# Altium schematic sheet gnss_module_evaluation_shield_schematic.SchDoc: GNSS Modules evaluation shield
size A4; ApprovedBy: -; Author: Morozov A. L.; Address1: morozovars@yandex.ru; Address2: Kazan; Address3: Russian Federation; SheetNumber: 1; SheetTotal: 1
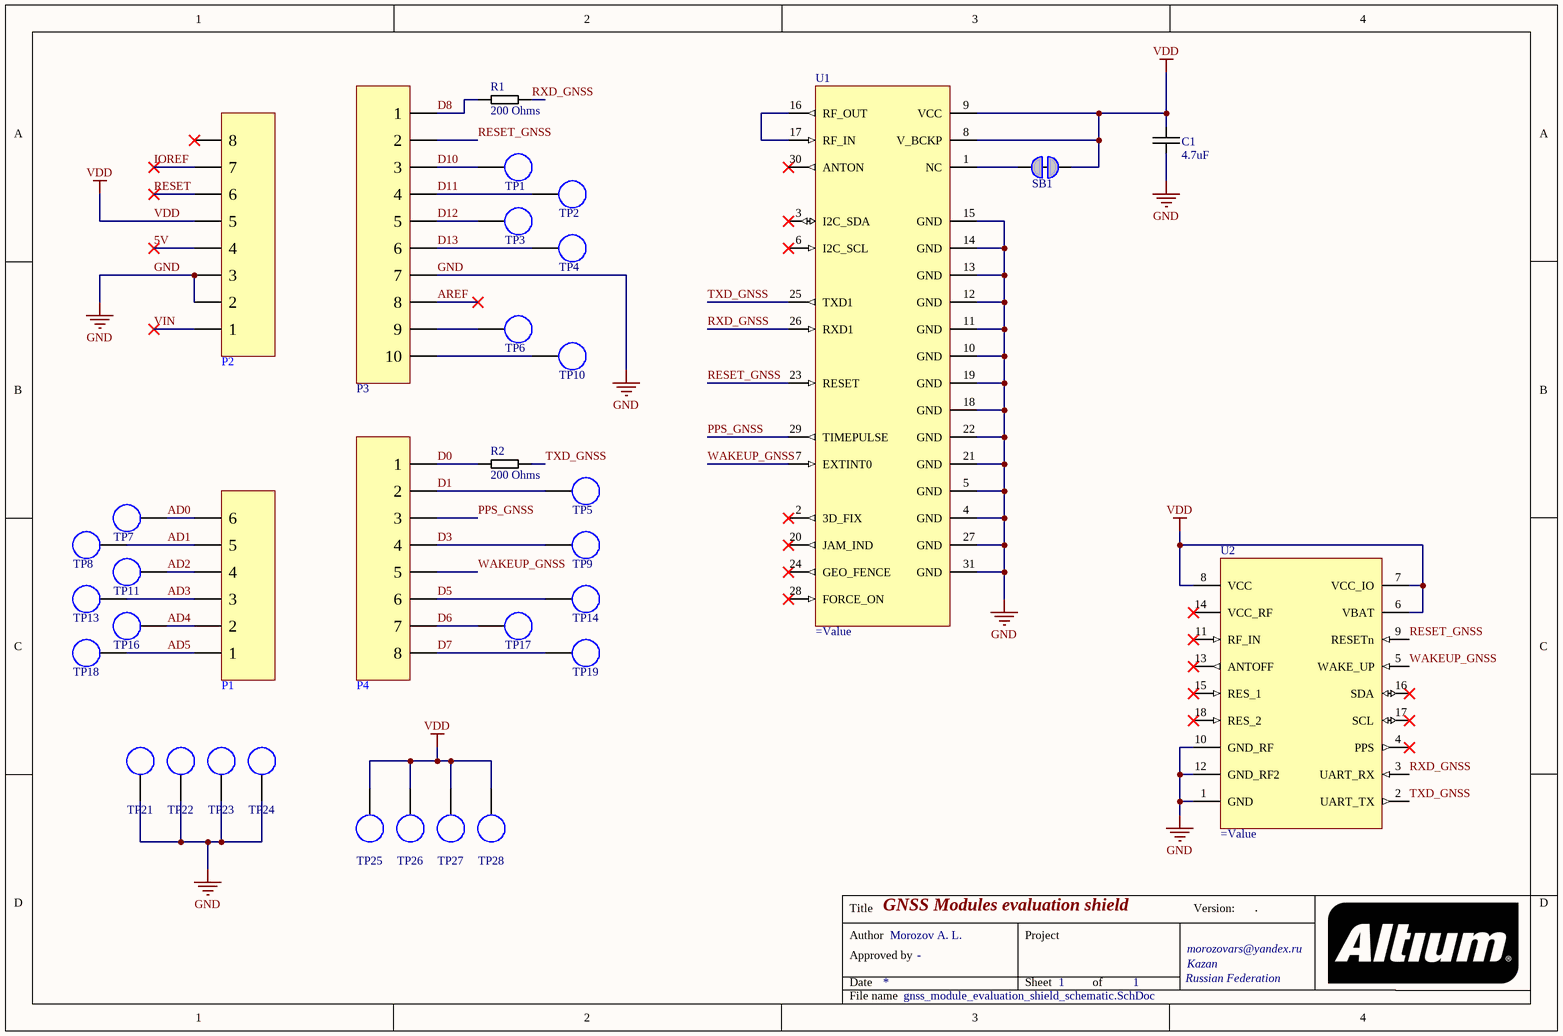
[diagram p0: gnss_module_evaluation_shield_schematic.SchDoc]

## Parts
C1  4.7uF  [CAP0805]
P1  SSQ-106-03-G-S  [Header 6x1 8.5mm]  (value not drawn)
P2  SSQ-108-03-G-S  [Header 8x1 8.5mm]  (value not drawn)
P3  SSQ-110-03-G-S  [Header 10x1 8.5mm]  (value not drawn)
P4  SSQ-108-03-G-S  [Header 8x1 8.5mm]  (value not drawn)
R1  200 Ohms  [R0402]
R2  200 Ohms  [R0402]
SB1  *  [Solderbridge_Shorted]  (value not drawn)  (net tie, no BOM)
TP1  *  [TP_1MM]  (value not drawn)  (no BOM)
TP2  *  [TP_1MM]  (value not drawn)  (no BOM)
TP3  *  [TP_1MM]  (value not drawn)  (no BOM)
TP4  *  [TP_1MM]  (value not drawn)  (no BOM)
TP5  *  [TP_1MM]  (value not drawn)  (no BOM)
TP6  *  [TP_1MM]  (value not drawn)  (no BOM)
TP7  *  [TP_1MM]  (value not drawn)  (no BOM)
TP8  *  [TP_1MM]  (value not drawn)  (no BOM)
TP9  *  [TP_1MM]  (value not drawn)  (no BOM)
TP10  *  [TP_1MM]  (value not drawn)  (no BOM)
TP11  *  [TP_1MM]  (value not drawn)  (no BOM)
TP13  *  [TP_1MM]  (value not drawn)  (no BOM)
TP14  *  [TP_1MM]  (value not drawn)  (no BOM)
TP16  *  [TP_1MM]  (value not drawn)  (no BOM)
TP17  *  [TP_1MM]  (value not drawn)  (no BOM)
TP18  *  [TP_1MM]  (value not drawn)  (no BOM)
TP19  *  [TP_1MM]  (value not drawn)  (no BOM)
TP21  *  [TP_1MM]  (value not drawn)  (no BOM)
TP22  *  [TP_1MM]  (value not drawn)  (no BOM)
TP23  *  [TP_1MM]  (value not drawn)  (no BOM)
TP24  *  [TP_1MM]  (value not drawn)  (no BOM)
TP25  *  [TP_1MM]  (value not drawn)  (no BOM)
TP26  *  [TP_1MM]  (value not drawn)  (no BOM)
TP27  *  [TP_1MM]  (value not drawn)  (no BOM)
TP28  *  [TP_1MM]  (value not drawn)  (no BOM)
U1  (no value)  [LCC-31]
U2  (no value)  [LCC-18]

## Nets
GND: C1.1 P2.2 P2.3 P3.7 TP21.1 TP22.1 TP23.1 TP24.1 U1.4(GND) U1.5(GND) U1.10(GND) U1.11(GND) U1.12(GND) U1.13(GND) U1.14(GND) U1.15(GND) U1.18(GND) U1.19(GND) U1.21(GND) U1.22(GND) U1.27(GND) U1.31(GND) U2.1(GND) U2.10(GND_RF) U2.12(GND_RF2)
VDD: C1.2 P2.5 SB1.1 TP25.1 TP26.1 TP27.1 TP28.1 U1.8(V_BCKP) U1.9(VCC) U2.6(VBAT) U2.7(VCC_IO) U2.8(VCC)
5V: P2.4
AD0: P1.6 TP7.1
AD1: P1.5 TP8.1
AD2: P1.4 TP11.1
AD3: P1.3 TP13.1
AD4: P1.2 TP16.1
AD5: P1.1 TP18.1
AREF: P3.8
D0: P4.1 R2.1
D1: P4.2 TP5.1
D3: P4.4 TP9.1
D5: P4.6 TP14.1
D6: P4.7 TP17.1
D7: P4.8 TP19.1
D8: P3.1 R1.1
D10: P3.3 TP1.1
D11: P3.4 TP2.1
D12: P3.5 TP3.1
D13: P3.6 TP4.1
IOREF: P2.7
PPS_GNSS: P4.3 U1.29(TIMEPULSE)
RESET: P2.6
RESET_GNSS: P3.2 U1.23(RESET) U2.9(RESETn)
RXD_GNSS: R1.2 U1.26(RXD1) U2.3(UART_RX)
TXD_GNSS: R2.2 U1.25(TXD1) U2.2(UART_TX)
VIN: P2.1
WAKEUP_GNSS: P4.5 U1.7(EXTINT0) U2.5(WAKE_UP)
NetP3_9: P3.9 TP6.1
NetP3_10: P3.10 TP10.1
NetSB1_2: SB1.2 U1.1(NC)
NetU1_16: U1.16(RF_OUT) U1.17(RF_IN)

Not connected (* = marked no-connect by the designer): P2 8*; U1 2(3D_FIX)* 3(I2C_SDA)* 6(I2C_SCL)* 20(JAM_IND)* 24(GEO_FENCE)* 28(FORCE_ON)* 30(ANTON)*; U2 4(PPS)* 11(RF_IN)* 13(ANTOFF)* 14(VCC_RF)* 15(RES_1)* 16(SDA)* 17(SCL)* 18(RES_2)*

## Notes on the sheet
- Title
- Version:
- .
- Date
- Author
- Approved by
- Sheet
- Project
- of
- File name

## Library data of the parts
C1 = GRM21BR71C475KE51L: CAP CER 4.7UF 16V X7R 0805; Manufacturer: Murata Electronics; Added by: Morozov A. L.; Assembled: 1; Designator: C?; Tolerance: 10%; Part Number: GRM21BR71C475KE51L; HelpURL: https://search.murata.co.jp/Ceramy/image/img/A01X/G101/ENG/GRM21BR71C475KE51-01.pdf; Operating temperature: -55 +125; Package: 0805; Price: 0.21; Released: 01-12-2019; Value: 4.7uF
P1 = SSQ-106-03-G-S: CONN RCPT 6POS 0.1 GOLD PCB / 6 Position Receptacle Connector 0.100" (2.54mm) Through Hole Gold; Manufacturer: Samtech Inc.; Added by: Morozov A. L.; Assembled: 0; Designator: P?; Part Number: SSQ-106-03-G-S; HelpURL: http://suddendocs.samtec.com/catalog_english/ssq_th.pdf; Operating temperature: -55 +125; Package: Pitch 2.54; Price: 1.38; Released: 02-10-2021
P2 P4 = SSQ-108-03-G-S: CONN RCP 8POS 0.1 GOLD PCB / 6 Position Receptacle Connector 0.100" (2.54mm) Through Hole Gold; Manufacturer: Samtech Inc.; Added by: Morozov A. L.; Assembled: 0; Designator: P?; Part Number: SSQ-108-03-G-S; HelpURL: http://suddendocs.samtec.com/catalog_english/ssq_th.pdf; Operating temperature: -55 +125; Package: Pitch 2.54; Price: 1.38; Released: 02-10-2021
P3 = SSQ-110-03-G-S: CONN RC 10POS 0.1 GOLD PCB / 6 Position Receptacle Connector 0.100" (2.54mm) Through Hole Gold; Manufacturer: Samtech Inc.; Added by: Morozov A. L.; Assembled: 0; Designator: P?; Part Number: SSQ-110-03-G-S; HelpURL: http://suddendocs.samtec.com/catalog_english/ssq_th.pdf; Operating temperature: -55 +125; Package: Pitch 2.54; Price: 1.38; Released: 02-10-2021
R1 R2 = RC0402FR-07200RL: RES SMD 200 OHM 1% 1/16W 0402; Manufacturer: Yageo; Added by: Morozov A. L.; Assembled: 1; Designator: R?; Part Number: RC0402FR-07200RL; HelpURL: https://www.yageo.com/upload/media/product/productsearch/datasheet/rchip/PYu-RC_Group_51_RoHS_L_10.pdf; Operating temperature: -55 +155; Package: 0402; Price: 0.1; Released: 25-01-2020; Value: 200 Ohms; Tolerance: 1%
SB1 = Solderbridge shorted: Solder bridge shorted; Designator: SB?; Added by: Morozov A. L.; Assembled: 0; Part Number: Solderbridge shorted; Type: Solder bridge; Price: -; Released: 02-10-2021
TP1-TP11 TP13 TP14 TP16-TP19 TP21-TP28 = Test Point 1MM: Test point; Designator: TP?; Added by: Morozov A. L.; Assembled: 1; Part Number: Test Point 1MM; Type: Test point; Price: -; Released: 17-02-2020
U1 = L96-M33: Navigation BeiDou, Galileo, GLONASS, GPS, GNSS Transceiver Module 1.561GHz, 1.575GHz, 1.602GHz Integrated, Chip Surface Mount; Manufacturer: Quectel; Added by: Morozov A. L.; Assembled: 0; Designator: U?; Part Number: L96-M33; HelpURL: https://www.quectel.com/product/gnss-l96/; Operating temperature: -40 to 85; Package: LCC-31; Released: 27-08-2021; Value: L96-M33; Price: -
U2 = Teseo-LIV3R: BeiDou, GLONASS, GNSS, GPS 1.561GHz, 1.575MHz -163dBm   18-LCC (9.7x10.1); Manufacturer: STMicroelectronics; Assembled: 1; Added by: Morozov A. L.; Designator: U?; Value: Teseo-LIV3R; Part Number: Teseo-LIV3R; HelpURL: https://www.st.com/resource/en/datasheet/teseo-liv3r.pdf; Package: LCC-18; Released: 29-11-2019; Operating temperature: -40 to 85; Price: 11.47